# Altium project Project Kraken (The Ultimate ESP32-S3 dev board).PrjPcb (part 2 of 5)

## Sheet Power section.SchDoc
size A3; SheetNumber: 5; SheetTotal: 9
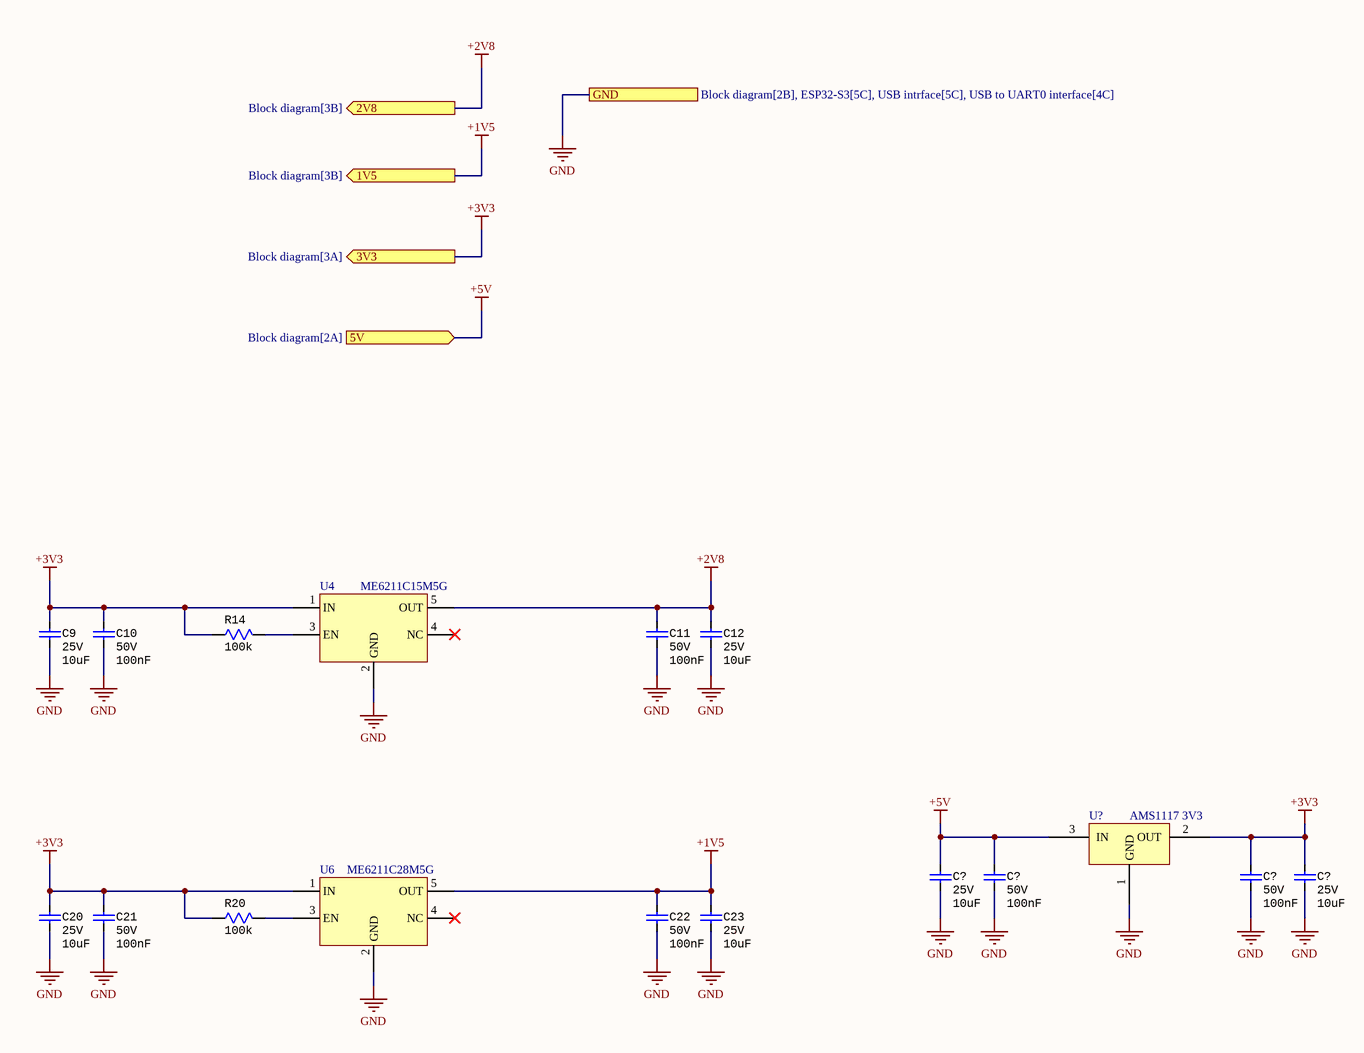
[diagram p4: Power section.SchDoc]

### Parts
(Parts that share a designator on the sheet are numbered #1, #2 ... from top to bottom, then left to right.)
C9  Voltage: 25V  [CAP Ceramic SMD 1206]  (hidden comment: 10uF)
C10  Voltage: 50V  [CAP Ceramic SMD 0603]  (hidden comment: 100nF)
C11  Voltage: 50V  [CAP Ceramic SMD 0603]  (hidden comment: 100nF)
C12  Voltage: 25V  [CAP Ceramic SMD 1206]  (hidden comment: 10uF)
C20  Voltage: 25V  [CAP Ceramic SMD 1206]  (hidden comment: 10uF)
C21  Voltage: 50V  [CAP Ceramic SMD 0603]  (hidden comment: 100nF)
C22  Voltage: 50V  [CAP Ceramic SMD 0603]  (hidden comment: 100nF)
C23  Voltage: 25V  [CAP Ceramic SMD 1206]  (hidden comment: 10uF)
C?#1  Voltage: 25V  [CAP Ceramic SMD 1206]  (hidden comment: 10uF)
C?#2  Voltage: 50V  [CAP Ceramic SMD 0603]  (hidden comment: 100nF)
C?#3  Voltage: 50V  [CAP Ceramic SMD 0603]  (hidden comment: 100nF)
C?#4  Voltage: 25V  [CAP Ceramic SMD 1206]  (hidden comment: 10uF)
R14  100k  [RES SMD 0603]
R20  100k  [RES SMD 0603]
U4  ME6211C15M5G  [SOT23-5]
U6  ME6211C28M5G  [SOT23-5]
U?#1  AMS1117 3V3  [Linear reagulator SMD AMS1117]

### Ports
1V5 (out, see Block diagram[3B]), 2V8 (out, see Block diagram[3B]), 3V3 (out, see Block diagram[3A]), 5V (in, see Block diagram[2A]), GND (see Block diagram[2B], ESP32-S3[5C], USB intrface[5C], USB to UART0 interface[4C])

### Nets
+1V5: C22.1 C23.1 U6.5(OUT) ; port 1V5
+2V8: C11.1 C12.1 U4.5(OUT) ; port 2V8
+3V3: C9.1 C10.1 C20.1 C21.1 C?#3.1 C?#4.1 R14.1 R20.1 U4.1(IN) U6.1(IN) U?#1.2(OUT) ; port 3V3
+5V: C?#1.1 C?#2.1 U?#1.3(IN) ; port 5V  [project net +5]
GND: C9.2 C10.2 C11.2 C12.2 C20.2 C21.2 C22.2 C23.2 C?#1.2 C?#2.2 C?#3.2 C?#4.2 U4.2(GND) U6.2(GND) U?#1.1(GND) ; port GND
NetR14_2: R14.2 U4.3(EN)
NetR20_2: R20.2 U6.3(EN)

Not connected (* = marked no-connect by the designer): U4 4(NC)*; U6 4(NC)*

### Library data of the parts
C9 C12 C20 C23 C?#1 C?#4 = CAP 1206 10uF 25V: Ceramic capacitor SMD-1206 10000nF (10uF) /25V X7R# K 10%, Samsung, RoHS/4k/; Manufacturer Part Number: CL31B106KAHNNNE; Dielectric: X7R; Supplier 1: LCSC; Manufacturer: Samsung; RoHS: Yes; Category: Ceramic Capacitors; Stock 1: 663420; Pricing 1: 20=0.033200, 200=0.025500, 600=0.022100, 2000=0.019600, 10000=0.018600, 20000=0.017900 (AUD); Mount: Surface Mount; Case/Package: 1206; Case Code (Imperial): 1206; Case Code (Metric): 3216; Min Operating Temperature: -55°C; Max Operating Temperature: 125°C; Capacitance: 10uF; Tolerance: 10%; Voltage Rating: 25V; Packaging: Tape and Reel; Package Quantity: 1; Length: 3.2mm; Width: 0.063inch; Height: 1.6mm; Thickness: 0.071inch; RoHS Compliant: Yes; ComponentLink1URL: https://datasheet.ciiva.com/25795/cl31b106kahnnne-25795260.pdf?src-supplier=Digi-Key; ComponentLink1Description: https://datasheet.ciiva.com/25795/cl31b106kahnnne-25795260.pdf?src-supplier=Digi-Key; ComponentLink2URL: https://datasheet.ciiva.com/26838/getdatasheetpartid-356415-26838914.pdf?src-supplier=Verical; ComponentLink2Description: https://datasheet.ciiva.com/26838/getdatasheetpartid-356415-26838914.pdf?src-supplier=Verical; ComponentLink3URL: https://datasheet.ciiva.com/16498/cl03a105mq3csnc-16498474.pdf?src-supplier=Future+Electronics; ComponentLink3Description: https://datasheet.ciiva.com/16498/cl03a105mq3csnc-16498474.pdf?src-supplier=Future+Electronics; Supplier Part Number 1: C14860; Value: 10uF; Depth: 1.6mm; ComponentLink10URL: https://datasheet.ciiva.com/25795/cl31b106kahnnne-25795260.pdf?src-supplier=Digi-Key; ComponentLink10Description: https://datasheet.ciiva.com/25795/cl31b106kahnnne-25795260.pdf?src-supplier=Digi-Key; ComponentLink11URL: https://datasheet.ciiva.com/26838/getdatasheetpartid-356415-26838914.pdf?src-supplier=Verical; ComponentLink11Description: https://datasheet.ciiva.com/26838/getdatasheetpartid-356415-26838914.pdf?src-supplier=Verical; ComponentLink12URL: https://datasheet.ciiva.com/16498/cl03a105mq3csnc-16498474.pdf?src-supplier=Future+Electronics; ComponentLink12Description: https://datasheet.ciiva.com/16498/cl03a105mq3csnc-16498474.pdf?src-supplier=Future+Electronics; Series: CL; Construction: Flat; Radiation Hardening: No
C10 C11 C21 C22 C?#2 C?#3 = CAP 0603 100nF 50V: Multilayer Ceramic Capacitors MLCC Surface Mount 0603 0.1uF 50 Volts X7R 10%; Manufacturer: Murata; Manufacturer Part Number: GRM188R71H104KA93D; Insulation Resistance: 10GR; Supplier 1: LCSC; RoHS: Yes; Category: Ceramic Capacitors; Stock 1: 3546650; Pricing 1: 50=0.00420, 500=0.00330, 1500=0.00290, 5000=0.00260, 25000=0.00250, 50000=0.00240 (USD); Mount: Surface Mount; Case/Package: 0603; Number of Pins: 2; Case Code (Imperial): 0603; Case Code (Metric): 1608; Dielectric Material: Ceramic; Material: Ceramic; Contact Plating: Tin,Matte; Min Operating Temperature: -55°C; Max Operating Temperature: 125°C; Capacitance: 100nF; Tolerance: 10%; Packaging: Tape and Reel; Dielectric: X7R; Voltage Rating (DC): 50V; Termination: SMD/SMT; Package Quantity: 1; Voltage Rating: 50V; Length: 1.6mm; Width: 0.8mm; Height: 0.8mm; Depth: 0.8mm; Thickness: 0.035inch; Radiation Hardening: No; RoHS Compliant: Yes; REACH SVHC: No SVHC; Lead Free: Lead Free; ComponentLink1URL: https://datasheet.ciiva.com/19467/1857604-19467681.pdf?src-supplier=Jameco; ComponentLink1Description: https://datasheet.ciiva.com/19467/1857604-19467681.pdf?src-supplier=Jameco; ComponentLink2URL: https://datasheet.ciiva.com/11786/0900766b807a1cab-11786047.pdf?src-supplier=RSComponents; ComponentLink2Description: https://datasheet.ciiva.com/11786/0900766b807a1cab-11786047.pdf?src-supplier=RSComponents; ComponentLink3URL: https://datasheet.ciiva.com/29201/451744-da-01-en-vs-kondensator-0603-29201904.pdf?src-supplier=Conrad; ComponentLink3Description: https://datasheet.ciiva.com/29201/451744-da-01-en-vs-kondensator-0603-29201904.pdf?src-supplier=Conrad; ComponentLink4URL: https://datasheet.ciiva.com/7937/4360-7937659.pdf?src-supplier=Element14; ComponentLink4Description: https://datasheet.ciiva.com/7937/4360-7937659.pdf?src-supplier=Element14; ComponentLink5URL: https://datasheet.ciiva.com/14116/nmgrm-data-en-14116602.pdf?src-supplier=Distrelec; ComponentLink5Description: https://datasheet.ciiva.com/14116/nmgrm-data-en-14116602.pdf?src-supplier=Distrelec; ComponentLink6URL: https://datasheet.ciiva.com/48436/nmgrm-data-en-48436667.pdf?src-supplier=Distrelec; ComponentLink6Description: https://datasheet.ciiva.com/48436/nmgrm-data-en-48436667.pdf?src-supplier=Distrelec; ComponentLink7URL: https://datasheet.ciiva.com/28534/4360-28534245.pdf?src-supplier=Element14; ComponentLink7Description: https://datasheet.ciiva.com/28534/4360-28534245.pdf?src-supplier=Element14; ComponentLink8URL: https://datasheet.ciiva.com/131/partnumbering-e-01-131739.pdf?src-supplier=Digi-Key; ComponentLink8Description: https://datasheet.ciiva.com/131/partnumbering-e-01-131739.pdf?src-supplier=Digi-Key; ComponentLink9URL: https://datasheet.ciiva.com/131/partnumbering-e-01-131738.pdf?src-supplier=Digi-Key; ComponentLink9Description: https://datasheet.ciiva.com/131/partnumbering-e-01-131738.pdf?src-supplier=Digi-Key; ComponentLink10URL: https://datasheet.ciiva.com/131/partnumbering-e-01-131740.pdf?src-supplier=Digi-Key; ComponentLink10Description: https://datasheet.ciiva.com/131/partnumbering-e-01-131740.pdf?src-supplier=Digi-Key; ComponentLink11URL: https://datasheet.ciiva.com/7937/1747470-7937658.pdf?src-supplier=Element14; ComponentLink11Description: https://datasheet.ciiva.com/7937/1747470-7937658.pdf?src-supplier=Element14; Supplier Part Number 1: C77055; Value: 100nF
R14 R20 = RES 0603 100k 1%: RES SMD 100K OHM 1% 1/10W 0603; Manufacturer: Panasonic; Manufacturer Part Number: ERJ3EKF1003V; Temperature Coefficient: 100ppm/°C; Power Rating: 100mW; Voltage Rating: 75V; Supplier 1: LCSC; RoHS: Yes; Category: Chip SMD Resistors; Stock 1: 373100; Pricing 1: 50=0.00790, 500=0.00640, 1500=0.00550, 5000=0.00500, 25000=0.00460, 50000=0.00430 (USD); Mount: Surface Mount; Case/Package: 0603; Number of Pins: 2; Case Code (Imperial): 0603; Case Code (Metric): 1608; Contact Plating: Tin; Weight: 7.1E-05oz; Size Code: 0603; Min Operating Temperature: -55°C; Max Operating Temperature: 155°C; Tolerance: 1%; Packaging: Tape and Reel; Resistor Type: Thick Film; Series: ERJ; Termination: SMD/SMT; Number of Terminations: 2; Max Power Dissipation: 100mW; Features: Automotive AEC-Q200; Construction: Rectangular; Package Quantity: 5000; Resistance Tolerance: 1%; Voltage Rating (DC): 75V; Length: 1.6mm; Width: 0.8mm; Height: 0.022inch; Depth: 0.8mm; Radiation Hardening: No; RoHS Compliant: Yes; Military Standard: Not; REACH SVHC: No SVHC; Lead Free: Lead Free; ComponentLink1URL: https://datasheet.ciiva.com/34303/1987476-34303566.pdf?src-supplier=Jameco; ComponentLink1Description: https://datasheet.ciiva.com/34303/1987476-34303566.pdf?src-supplier=Jameco; ComponentLink2URL: https://datasheet.ciiva.com/16770/70260748-16770253.pdf?src-supplier=Allied+Electronics; ComponentLink2Description: https://datasheet.ciiva.com/16770/70260748-16770253.pdf?src-supplier=Allied+Electronics; ComponentLink3URL: https://datasheet.ciiva.com/16740/aoa0000ce2-16740662.pdf?src-supplier=Future+Electronics; ComponentLink3Description: https://datasheet.ciiva.com/16740/aoa0000ce2-16740662.pdf?src-supplier=Future+Electronics; ComponentLink4URL: https://datasheet.ciiva.com/15158/getdatasheetpartid-247527-15158907.pdf?src-supplier=Verical; ComponentLink4Description: https://datasheet.ciiva.com/15158/getdatasheetpartid-247527-15158907.pdf?src-supplier=Verical; ComponentLink5URL: https://datasheet.ciiva.com/30133/aoa0000ce2-30133845.pdf?src-supplier=Onlinecomponents.com; ComponentLink5Description: https://datasheet.ciiva.com/30133/aoa0000ce2-30133845.pdf?src-supplier=Onlinecomponents.com; Supplier Part Number 1: C189597; Resistance: 100k
U4 = ME6211C15M5G: 300mA 70dB@(1kHz) Fixed 1.5V~1.5V Positive 1 6V SOT-23-5 Linear Voltage Regulators (LDO) ROHS; Manufacturer: BROADCHIP; ManufacturerPartNumber: BCT2028EUK28-TR; Supplier: LCSC; SupplierPartNumber: C53100
U6 = ME6211C28M5G: 500mA 77dB@(217Hz) 500mV@(500mA) Fixed 2.8V~2.8V 1 5.5V SOT-23-5 Linear Voltage Regulators (LDO) ROHS; Manufacturer: BROADCHIP; ManufacturerPartNumber: BCT2028EUK28-TR; Supplier: LCSC; SupplierPartNumber: C266765
U?#1 = AMS1117 3V3: Fixed Positive LDO Regulator, 3.3V, 1.3V Dropout, PDSO3; Manufacturer: Advanced Monolithic Systems; Manufacturer Part Number: AMS1117-3.3; Supplier 1: LCSC; RoHS: Yes; Category: Voltage Regulators - Linear; Stock 1: 262030; Pricing 1: 5=0.16010, 50=0.12830, 150=0.11280, 500=0.09900, 2500=0.09520, 5000=0.09290 (USD); RoHS Compliant: Yes; Supplier Part Number 1: C6186